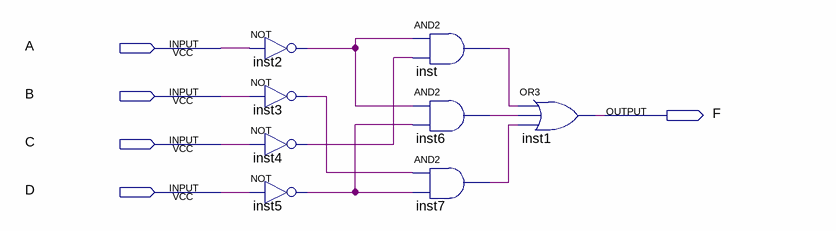
[diagram p0: schematic sheet]
// Quartus schematic Question1.bdf as structural Verilog: 8 symbols, 5 pins
module Question1 (
  input  A,
  input  B,
  input  C,
  input  D,
  output F
);

  wire inst2_out, inst3_out, inst4_out, inst5_out, inst6_out, inst7_out, inst_out;

  not inst2 (inst2_out, A);
  not inst3 (inst3_out, B);
  not inst4 (inst4_out, C);
  not inst5 (inst5_out, D);
  and inst (inst_out, inst2_out, inst4_out);
  and inst6 (inst6_out, inst2_out, inst5_out);
  and inst7 (inst7_out, inst3_out, inst5_out);
  or inst1 (F, inst_out, inst6_out, inst7_out);
endmodule
